# Altium schematic sheet khoinguon.SchDoc: So do nguyen li
size A; Author: HUNG_DANG; DrawnBy: * Luwamh; SheetNumber: 1; SheetTotal: 1
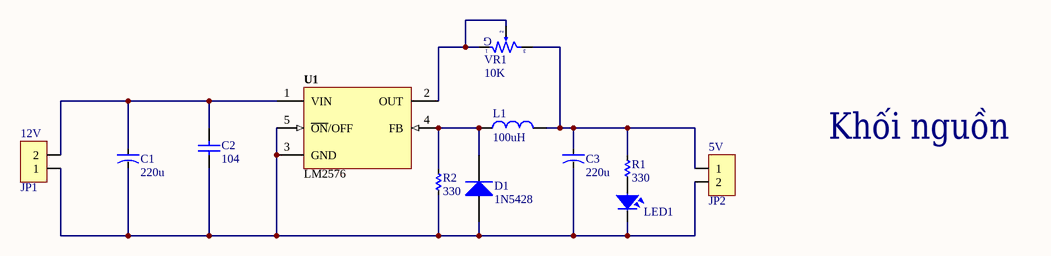
[diagram p0: khoinguon.SchDoc]

## Parts
5V  JP2  [JP2-C1T]
12V  JP1  [JP2-C1T]
C1  220u  [CA-ALU-2.54]
C2  104  [103/2KV]
C3  220u  [CA-ALU-2.54]
D1  1N5428  [DIODE/POW/1A]
L1  100uH  [L01]
LED1  LED  [LED-3MM-YELLOW]  (value not drawn)
R1  330  [RES-1/2W]
R2  330  [RES-1/2W]
U1  LM2576  [DIP5-T]
VR1  10K  [VR-S1]

## Nets
Net5V_1: 5V.1 C3.1 L1.2 R1.2 VR1.3
Net5V_2: 5V.2 12V.1 C1.2 C2.2 C3.2 D1.1(A) LED1.2 R2.1 U1.3(GND) U1.5(~{ON}/OFF)
Net12V_2: 12V.2 C1.1 C2.1 U1.1(VIN)
NetD1_2: D1.2(K) L1.1 R2.2 U1.4(FB)
NetLED1_1: LED1.1 R1.1
NetU1_2: U1.2(OUT) VR1.1 VR1.2

## Notes on the sheet
- Khối nguồn
- (in symbol VR-S) G

## Library data of the parts
5V 12V = JP2: WR-PHD 2.54 mm Angled Socket Header; Manufacturer: W¨¹rth Elektronik eiSos GmbH; partNo: 613002143121; ComponentLink1 Description: Manufacturer; ComponentLink2 Description: Datasheet; NoPins: 02; Created Date: 29 March 2013; ComponentLink1URL: http://www.we-online.com; ComponentLink2URL: http://katalog.we-online.de/em/datasheet/6130xx143121.pdf; Created by: Karrer Zheng
C1 C3 = CN-ALU-DIP: Capacitor (Semiconductor SIM Model); Value: 104; LatestRevisionDate: 17-Jul-2002; LatestRevisionNote: Re-released for DXP Platform.; PackageReference: C1206; Publisher: Altium Limited
C2 = Cap2KV: Published: 8-Jun-2000; LatestRevisionDate: 17-Jul-2002; LatestRevisionNote: Re-released for DXP Platform.; PackageReference: RAD-0.3; Publisher: Altium Limited
D1 = Diode Power: Published: 8-Jun-2000; LatestRevisionDate: 17-Jul-2002; LatestRevisionNote: Re-released for DXP Platform.; DatasheetDocument: 1998; PackageDocument: Aug-1999; PackageReference: DO-201AD; Publisher: Altium Limited; ComponentLink1Description: Manufacturer Link; ComponentLink1URL: http://www.fairchildsemi.com/; ComponentLink2Description: Datasheet; ComponentLink2URL: http://www.fairchildsemi.com/ds/1N%2F1N5400.pdf
L1 = L1: Inductor; Value: 150 mH
LED1 = LED: LED Single colour Green and Red; Value: LED 3 ly Single Colour
R1 R2 = Res: Manufacturer: Generic Components; Class: Passive; SubClass: R; Published: 08/06/2000; Publisher: Altium Hobart Technology Centre
U1 = LM2576: Max Input Voltage: 12 V; Max Output Current: 3 (6.0 peak) A; Max Output Voltage: mV; Category: IC-Power; Min Input Voltage: mV; Min Output Voltage: mV; Mounting Technology: Surface Mount; Status: Unreleased; Supply Voltage: mV; Temperature Range: -40 to +125 degC
VR1 = VR-S: Var Resistor; Value: Volume 50k